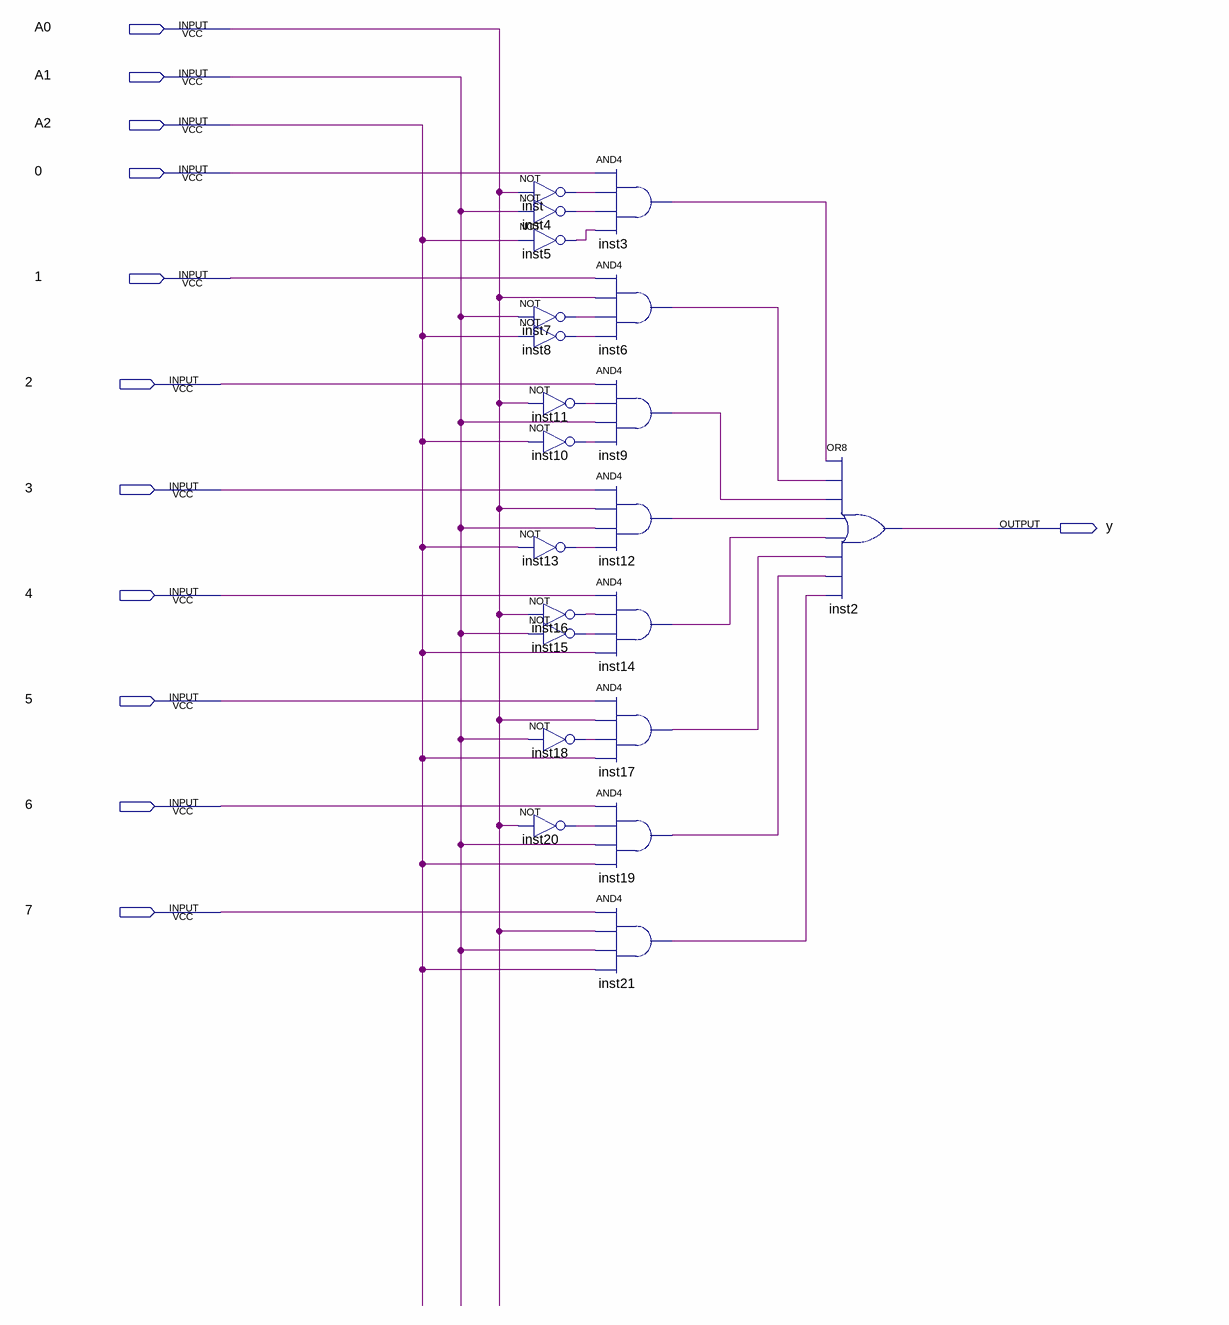
[diagram p0: schematic sheet]
// Quartus schematic MUX8_1.bdf as structural Verilog: 21 symbols, 12 pins
module MUX8_1 (
  input  A0,
  input  A1,
  input  A2,
  input  \0 ,
  input  \1 ,
  input  \2 ,
  input  \3 ,
  input  \4 ,
  input  \5 ,
  input  \6 ,
  input  \7 ,
  output y
);

  wire inst3_out, inst4_out, inst5_out, inst6_out, inst7_out, inst8_out, inst9_out, inst10_out, inst11_out,
       inst12_out, inst13_out, inst14_out, inst15_out, inst16_out, inst17_out, inst18_out, inst19_out,
       inst20_out, inst21_out, inst_out;

  not inst (inst_out, A0);
  not inst4 (inst4_out, A1);
  not inst5 (inst5_out, A2);
  not inst7 (inst7_out, A1);
  not inst8 (inst8_out, A2);
  not inst11 (inst11_out, A0);
  not inst10 (inst10_out, A2);
  not inst13 (inst13_out, A2);
  not inst16 (inst16_out, A0);
  not inst15 (inst15_out, A1);
  not inst18 (inst18_out, A1);
  not inst20 (inst20_out, A0);
  and inst3 (inst3_out, \0 , inst_out, inst4_out, inst5_out);
  and inst6 (inst6_out, \1 , A0, inst7_out, inst8_out);
  and inst9 (inst9_out, \2 , inst11_out, A1, inst10_out);
  and inst12 (inst12_out, \3 , A0, A1, inst13_out);
  and inst14 (inst14_out, \4 , inst16_out, inst15_out, A2);
  and inst17 (inst17_out, \5 , A0, inst18_out, A2);
  and inst19 (inst19_out, \6 , inst20_out, A1, A2);
  and inst21 (inst21_out, \7 , A0, A1, A2);
  or inst2 (y, inst3_out, inst6_out, inst9_out, inst12_out, inst14_out, inst17_out, inst19_out, inst21_out);
endmodule
